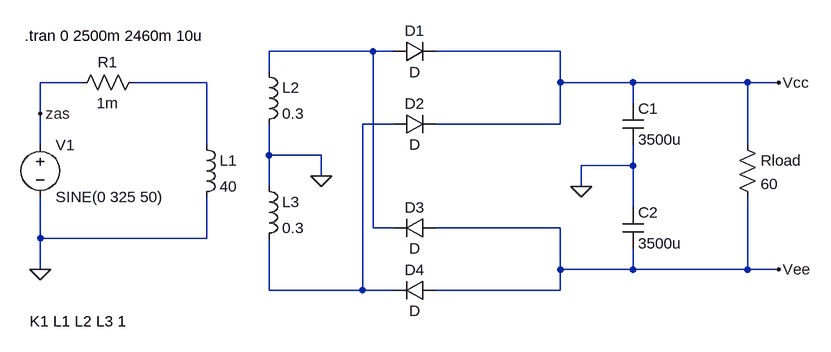
[diagram p0: schematic power.asc]
power.asc, the LTspice schematic file:
Version 4.1
SHEET 1 1520 1140
WIRE 576 64 416 64
WIRE 608 64 576 64
WIRE 864 64 672 64
WIRE 416 96 416 64
WIRE 128 112 64 112
WIRE 320 112 208 112
WIRE 864 112 864 64
WIRE 976 112 864 112
WIRE 1152 112 976 112
WIRE 1200 112 1152 112
WIRE 976 144 976 112
WIRE 64 160 64 112
WIRE 608 176 560 176
WIRE 864 176 864 112
WIRE 864 176 672 176
WIRE 64 208 64 160
WIRE 320 208 320 112
WIRE 1152 208 1152 112
WIRE 416 224 416 176
WIRE 496 224 416 224
WIRE 976 240 976 208
WIRE 976 240 896 240
WIRE 496 256 496 224
WIRE 416 272 416 224
WIRE 896 272 896 240
WIRE 976 304 976 240
WIRE 576 336 576 64
WIRE 608 336 576 336
WIRE 864 336 672 336
WIRE 64 352 64 288
WIRE 320 352 320 288
WIRE 320 352 64 352
WIRE 64 400 64 352
WIRE 864 400 864 336
WIRE 976 400 976 368
WIRE 976 400 864 400
WIRE 1152 400 1152 288
WIRE 1152 400 976 400
WIRE 1200 400 1152 400
WIRE 416 432 416 352
WIRE 560 432 560 176
WIRE 560 432 416 432
WIRE 608 432 560 432
WIRE 864 432 864 400
WIRE 864 432 672 432
FLAG 64 400 0
FLAG 496 256 0
FLAG 896 272 0
FLAG 1200 400 Vee
FLAG 1200 112 Vcc
FLAG 64 160 zas
SYMBOL voltage 64 192 R0
SYMATTR InstName V1
SYMATTR Value SINE(0 325 50)
SYMBOL res 224 96 R90
WINDOW 0 0 56 VBottom 2
WINDOW 3 32 56 VTop 2
SYMATTR InstName R1
SYMATTR Value 1m
SYMBOL ind 304 192 R0
SYMATTR InstName L1
SYMATTR Value 40
SYMATTR Type ind
SYMBOL ind 400 80 R0
SYMATTR InstName L2
SYMATTR Value 0.3
SYMATTR Type ind
SYMBOL ind 400 256 R0
SYMATTR InstName L3
SYMATTR Value 0.3
SYMATTR Type ind
SYMBOL diode 608 80 R270
WINDOW 0 32 32 VTop 2
WINDOW 3 0 32 VBottom 2
SYMATTR InstName D1
SYMBOL diode 608 192 R270
WINDOW 0 32 32 VTop 2
WINDOW 3 0 32 VBottom 2
SYMATTR InstName D2
SYMBOL diode 672 320 R90
WINDOW 0 0 32 VBottom 2
WINDOW 3 32 32 VTop 2
SYMATTR InstName D3
SYMBOL diode 672 416 R90
WINDOW 0 0 32 VBottom 2
WINDOW 3 32 32 VTop 2
SYMATTR InstName D4
SYMBOL cap 960 144 R0
SYMATTR InstName C1
SYMATTR Value 3500u
SYMBOL cap 960 304 R0
SYMATTR InstName C2
SYMATTR Value 3500u
SYMBOL res 1136 192 R0
SYMATTR InstName Rload
SYMATTR Value 60
TEXT 48 480 Left 2 !K1 L1 L2 L3 1
TEXT 40 40 Left 2 !.tran 0 2500m 2460m 10u

The netlist it stands for:
* power.asc
V1 zas 0 SINE(0 325 50)
R1 N002 zas 1m
L1 N002 0 40
L2 N001 0 0.3
L3 0 N003 0.3
D1 N001 Vcc D
D2 N003 Vcc D
D3 Vee N001 D
D4 Vee N003 D
C1 Vcc 0 3500u
C2 0 Vee 3500u
Rload Vcc Vee 60
.model D D
.lib standard.dio
K1 L1 L2 L3 1
.tran 0 2500m 2460m 10u
.backanno
.end